# Altium schematic sheet [04] - SDRAM.SchDoc
size A3; DocumentNumber: 4; SheetNumber: 4; SheetTotal: 18
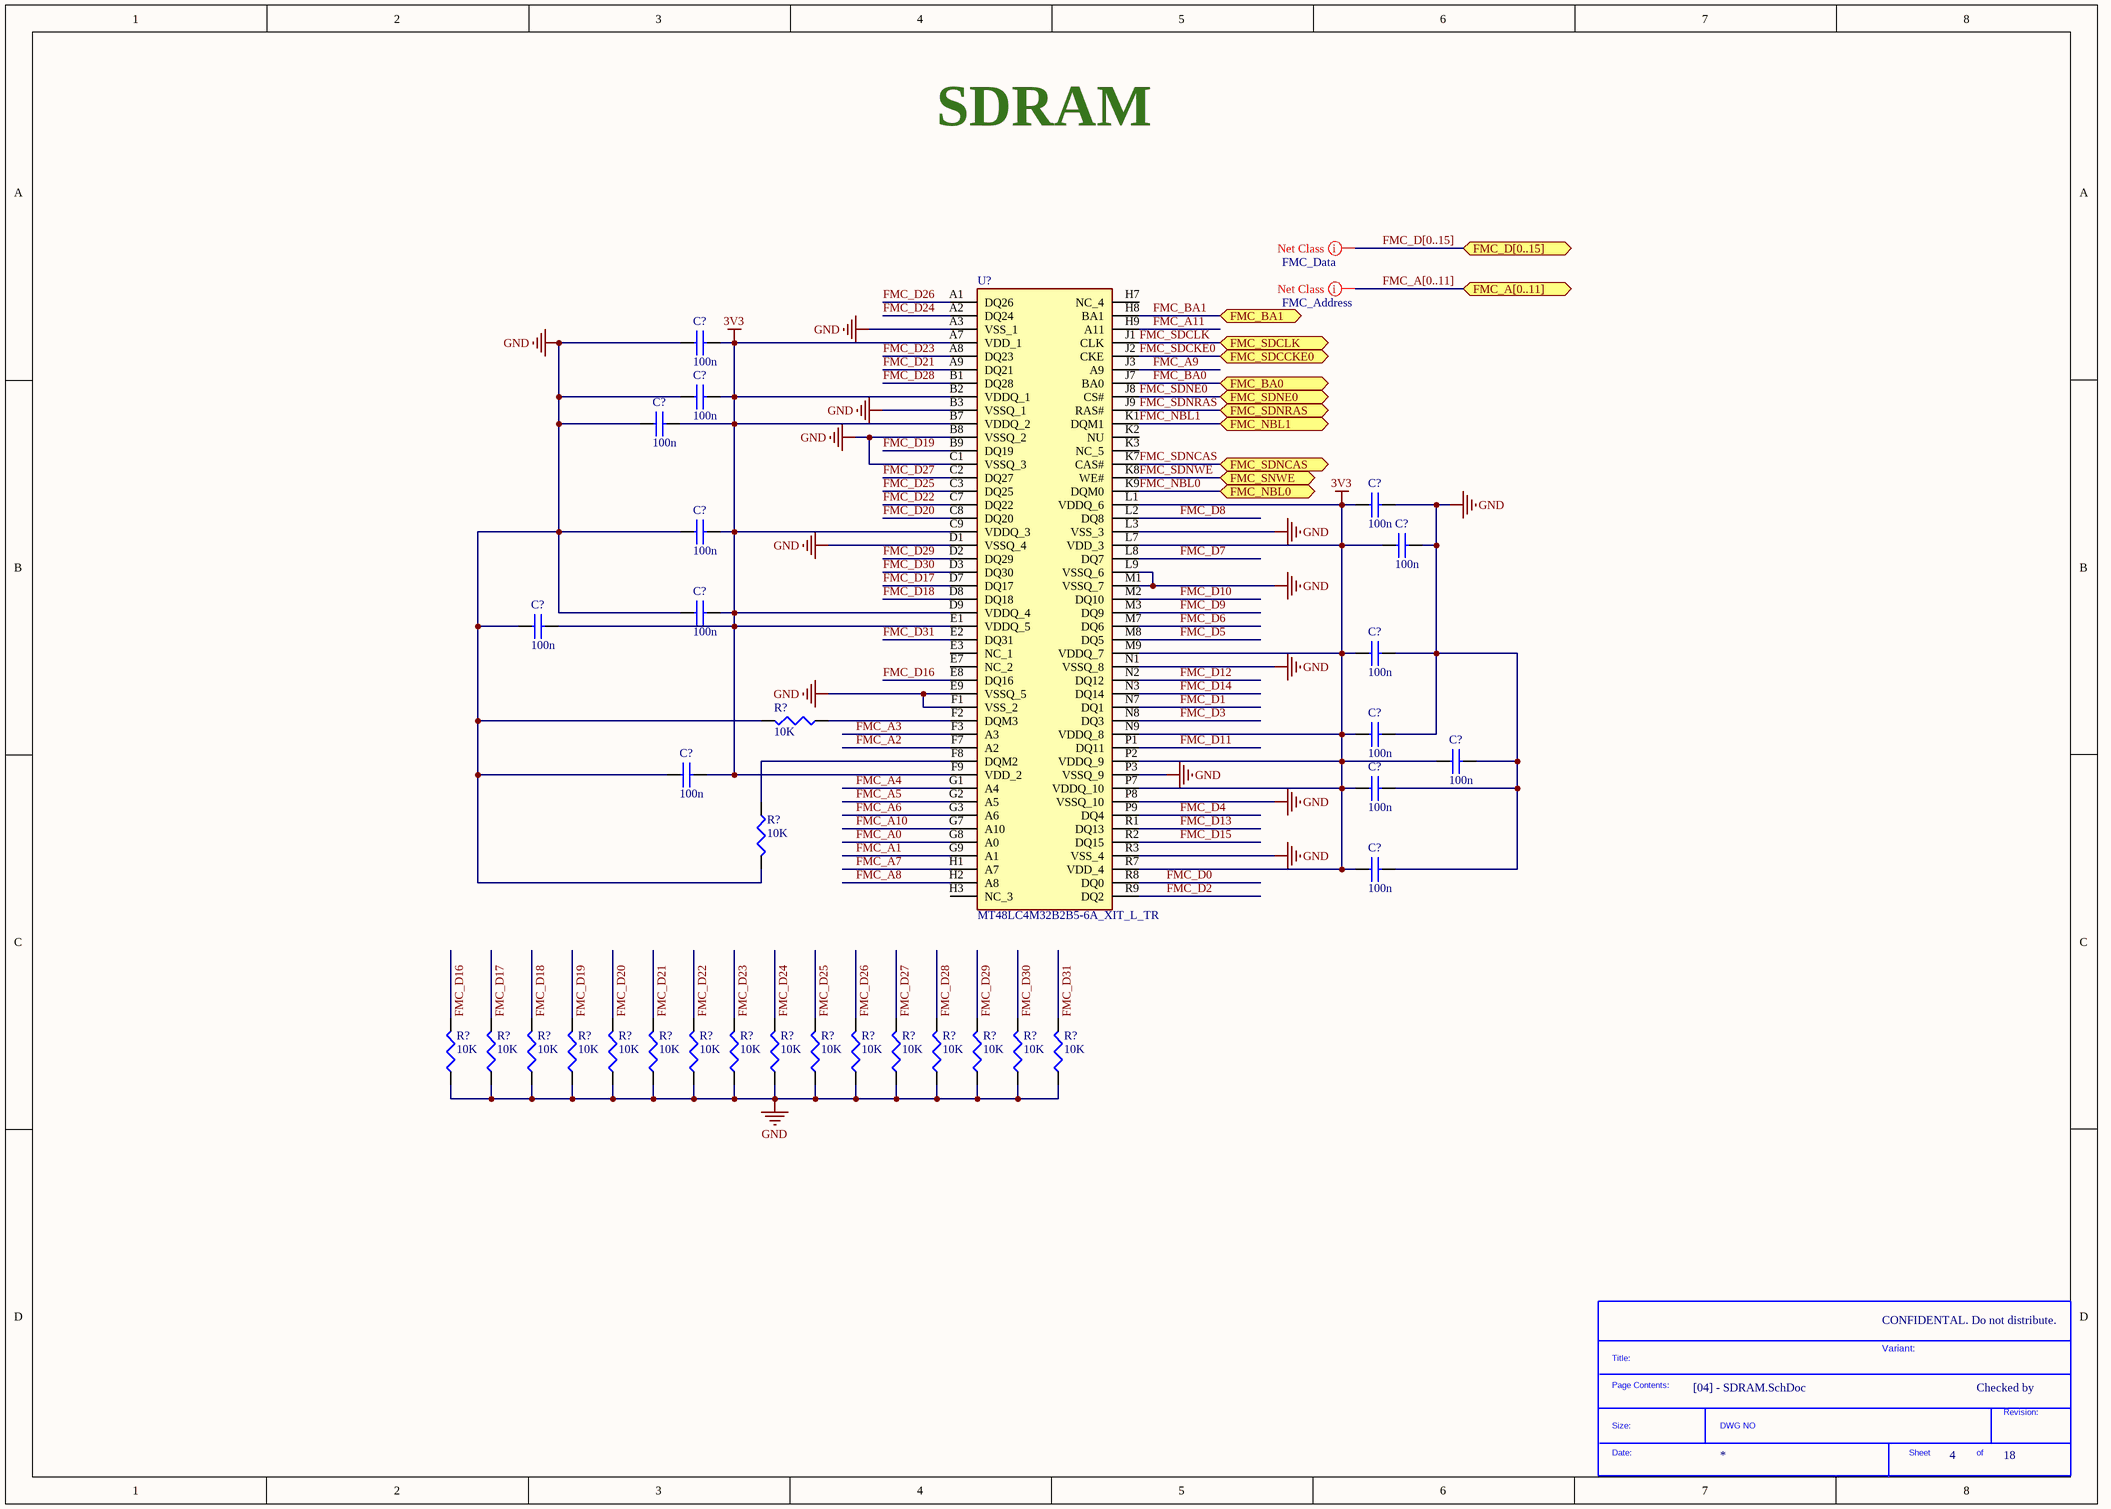
[diagram p0: [04] - SDRAM.SchDoc]

## Parts
(Parts that share a designator on the sheet are numbered #1, #2 ... from top to bottom, then left to right.)
*  SDTitleBlock  (value not drawn)  (graphical)
C?#1  100n  [C0402]
C?#2  100n  [C0402]
C?#3  100n  [C0402]
C?#4  100n  [C0402]
C?#5  100n  [C0402]
C?#6  100n  [C0402]
C?#7  100n  [C0402]
C?#8  100n  [C0402]
C?#9  100n  [C0402]
C?#10  100n  [C0402]
C?#11  100n  [C0402]
C?#12  100n  [C0402]
C?#13  100n  [C0402]
C?#14  100n  [C0402]
R?#1  10K  [R0402]
R?#2  10K  [R0402]
R?#3  10K  [R0402]
R?#4  10K  [R0402]
R?#5  10K  [R0402]
R?#6  10K  [R0402]
R?#7  10K  [R0402]
R?#8  10K  [R0402]
R?#9  10K  [R0402]
R?#10  10K  [R0402]
R?#11  10K  [R0402]
R?#12  10K  [R0402]
R?#13  10K  [R0402]
R?#14  10K  [R0402]
R?#15  10K  [R0402]
R?#16  10K  [R0402]
R?#17  10K  [R0402]
R?#18  10K  [R0402]
U?  MT48LC4M32B2B5-6A_XIT_L_TR  [BGA90C80P9X15_800X1300X70]

## Ports
FMC_A[0..11] (bidir), FMC_BA0 (bidir), FMC_BA1 (bidir), FMC_D[0..15] (bidir), FMC_NBL0 (bidir), FMC_NBL1 (bidir), FMC_SDCCKE0 (bidir), FMC_SDCLK (bidir), FMC_SDNCAS (bidir), FMC_SDNE0 (bidir), FMC_SDNRAS (bidir), FMC_SNWE (bidir)

## Nets
3V3: C?#1.2 C?#2.2 C?#3.2 C?#4.1 C?#5.2 C?#6.1 C?#7.2 C?#8.2 C?#9.1 C?#10.1 C?#11.1 C?#12.2 C?#13.1 C?#14.1 U?.A7(VDD_1) U?.B2(VDDQ_1) U?.B7(VDDQ_2) U?.C9(VDDQ_3) U?.D9(VDDQ_4) U?.E1(VDDQ_5) U?.F9(VDD_2) U?.L1(VDDQ_6) U?.L7(VDD_3) U?.M9(VDDQ_7) U?.N9(VDDQ_8) U?.P2(VDDQ_9) U?.P7(VDDQ_10) U?.R7(VDD_4)
GND: C?#1.1 C?#2.1 C?#3.1 C?#4.2 C?#5.1 C?#6.2 C?#7.1 C?#8.1 C?#9.2 C?#10.2 C?#11.2 C?#12.1 C?#13.2 C?#14.2 R?#1.2 R?#2.2 R?#3.1 R?#4.1 R?#5.1 R?#6.1 R?#7.1 R?#8.1 R?#9.1 R?#10.1 R?#11.1 R?#12.1 R?#13.1 R?#14.1 R?#15.1 R?#16.1 R?#17.1 R?#18.1 U?.A3(VSS_1) U?.B3(VSSQ_1) U?.B8(VSSQ_2) U?.C1(VSSQ_3) U?.D1(VSSQ_4) U?.E9(VSSQ_5) U?.F1(VSS_2) U?.L3(VSS_3) U?.L9(VSSQ_6) U?.M1(VSSQ_7) U?.N1(VSSQ_8) U?.P3(VSSQ_9) U?.P8(VSSQ_10) U?.R3(VSS_4)
FMC_A0: U?.G8(A0)
FMC_A1: U?.G9(A1)
FMC_A2: U?.F7(A2)
FMC_A3: U?.F3(A3)
FMC_A4: U?.G1(A4)
FMC_A5: U?.G2(A5)
FMC_A6: U?.G3(A6)
FMC_A7: U?.H1(A7)
FMC_A8: U?.H2(A8)
FMC_A9: U?.J3(A9)
FMC_A10: U?.G7(A10)
FMC_A11: U?.H9(A11)
FMC_BA0: U?.J7(BA0) ; port FMC_BA0
FMC_BA1: U?.H8(BA1) ; port FMC_BA1
FMC_D0: U?.R8(DQ0)
FMC_D1: U?.N7(DQ1)
FMC_D2: U?.R9(DQ2)
FMC_D3: U?.N8(DQ3)
FMC_D4: U?.P9(DQ4)
FMC_D5: U?.M8(DQ5)
FMC_D6: U?.M7(DQ6)
FMC_D7: U?.L8(DQ7)
FMC_D8: U?.L2(DQ8)
FMC_D9: U?.M3(DQ9)
FMC_D10: U?.M2(DQ10)
FMC_D11: U?.P1(DQ11)
FMC_D12: U?.N2(DQ12)
FMC_D13: U?.R1(DQ13)
FMC_D14: U?.N3(DQ14)
FMC_D15: U?.R2(DQ15)
FMC_D16: R?#3.2 U?.E8(DQ16)
FMC_D17: R?#4.2 U?.D7(DQ17)
FMC_D18: R?#5.2 U?.D8(DQ18)
FMC_D19: R?#6.2 U?.B9(DQ19)
FMC_D20: R?#7.2 U?.C8(DQ20)
FMC_D21: R?#8.2 U?.A9(DQ21)
FMC_D22: R?#9.2 U?.C7(DQ22)
FMC_D23: R?#10.2 U?.A8(DQ23)
FMC_D24: R?#11.2 U?.A2(DQ24)
FMC_D25: R?#12.2 U?.C3(DQ25)
FMC_D26: R?#13.2 U?.A1(DQ26)
FMC_D27: R?#14.2 U?.C2(DQ27)
FMC_D28: R?#15.2 U?.B1(DQ28)
FMC_D29: R?#16.2 U?.D2(DQ29)
FMC_D30: R?#17.2 U?.D3(DQ30)
FMC_D31: R?#18.2 U?.E2(DQ31)
FMC_NBL0: U?.K9(DQM0) ; port FMC_NBL0
FMC_NBL1: U?.K1(DQM1) ; port FMC_NBL1
FMC_SDCKE0: U?.J2(CKE) ; port FMC_SDCCKE0
FMC_SDCLK: U?.J1(CLK) ; port FMC_SDCLK
FMC_SDNCAS: U?.K7(CAS#) ; port FMC_SDNCAS
FMC_SDNE0: U?.J8(CS#) ; port FMC_SDNE0
FMC_SDNRAS: U?.J9(RAS#) ; port FMC_SDNRAS
FMC_SDNWE: U?.K8(WE#) ; port FMC_SNWE
NetR?#1_1: R?#1.1 U?.F2(DQM3)
NetR?#2_1: R?#2.1 U?.F8(DQM2)

Not connected (* = marked no-connect by the designer): U? E3(NC_1) E7(NC_2) H3(NC_3) H7(NC_4) K2(NU) K3(NC_5)

## Buses and harness runs
bus FMC_A[0..11] = port FMC_A[0..11]
bus FMC_D[0..15] = port FMC_D[0..15]

## Layout directives
net class FMC_Data: (no net found under the mark)
net class FMC_Address: (no net found under the mark)

## Notes on the sheet
- SDRAM
- CONFIDENTAL. Do not distribute.
- CLOCKS (CPU & PCIE)
- Variant:
- Checked by
- (in symbol SDTitleBlock) Title:; Page Contents:; Revision:; Size:; DWG NO; Date:; Sheet; of

## Library data of the parts
C?#1-C?#14 = C1005X5R1H104K: CAP CER .10UF 50V X5R 10% 0402; Manufacturer: TDK Corporation; Capacitance: 0.1µF; Value: 100nF; .Checked PCB: used; Category: Capacitors; Supplier Part Number: 445-5942-1-ND; Manufacturer Part Number: C1005X5R1H104K; Operating Temperature: -55°C ~ 85°C; Package / Case: 0402 (1005 Metric); Price 1k [$]: 0.02340; .Checked SCH: used; Voltage - Rated: 50V; Supplier: Digikey; Supplier 1: Digi-Key; Supplier Part Number 1: 445-5942-1-ND; RoHS: RoHS Compliant; Stock 1: 106926; Pricing 1: 1=0.27, 10=0.18, 100=0.072, 250=0.05176, 500=0.0369, 1000=0.027 (USD); Tolerance: ±10%; Temperature Coefficient: X5R; Mounting Type: Surface Mount, MLCC; Applications: General Purpose; Ratings: -; Size / Dimension: 0.039" L x 0.020" W (1.00mm x 0.50mm); Height - Seated (Max): -; Thickness (Max): 0.022" (0.55mm); Lead Spacing: -; Features: -; Packaging: Cut Tape (CT); Lead Style: -; ComponentLink1URL: http://www.tdk.co.jp/tefe02/e412_c.pdf; ComponentLink1Description: http://www.tdk.co.jp/tefe02/e412_c.pdf
R?#1-R?#18 = RC0402FR-0710KL: RES 10.0K OHM 1/16W 1% 0402 SMD; Manufacturer: Yageo; Power (Watts): 0.063W, 1/16W; .Checked PCB: used; Temperature Coefficient: ±100ppm/°C; Category: Resistors; Supplier Part Number: 311-10.0KLRCT-ND; Manufacturer Part Number: RC0402FR-0710KL; Package / Case: 0402 (1005 Metric); Price 1k [$]: 0.01421; Resistance (Ohms): 10K; Tolerance: ±1%; Value: 10k; .Checked SCH: used; Supplier: Digikey; Supplier 1: Digi-Key; Supplier Part Number 1: 311-10.0KLRCT-ND; RoHS: RoHS Compliant; Stock 1: 2916495; Pricing 1: 10=0.014, 50=0.0104, 100=0.0079, 250=0.00584, 500=0.00432, 1000=0.00288 (USD); Composition: Thick Film; Features: -; Size / Dimension: 0.039" L x 0.020" W (1.00mm x 0.50mm); Height: 0.016" (0.40mm); Number of Terminations: 2; Packaging: Cut Tape (CT); ComponentLink1URL: http://www.yageo.com/documents/recent/PYu-RC0402_51_RoHS_L_6.pdf; ComponentLink1Description: http://www.yageo.com/documents/recent/PYu-RC0402_51_RoHS_L_6.pdf
U? = MT48LC4M32B2B5-6A_XIT_L_TR: Integrated Circuit; Manufacturer_Name: Micron; Manufacturer_Part_Number: MT48LC4M32B2B5-6A XIT:L TR; Datasheet Link: http://www.micron.com/~/media/Documents/Products/Data%20Sheet/DRAM/128mb_x32_sdram.pdf; Height: 0.7mm; Mouser Part Number: 340-140098-REEL; Mouser Price/Stock: https://www.mouser.com/Search/Refine.aspx?Keyword=340-140098-REEL